# EAGLE schematic pmod_debug (EAGLE 6.4.4)
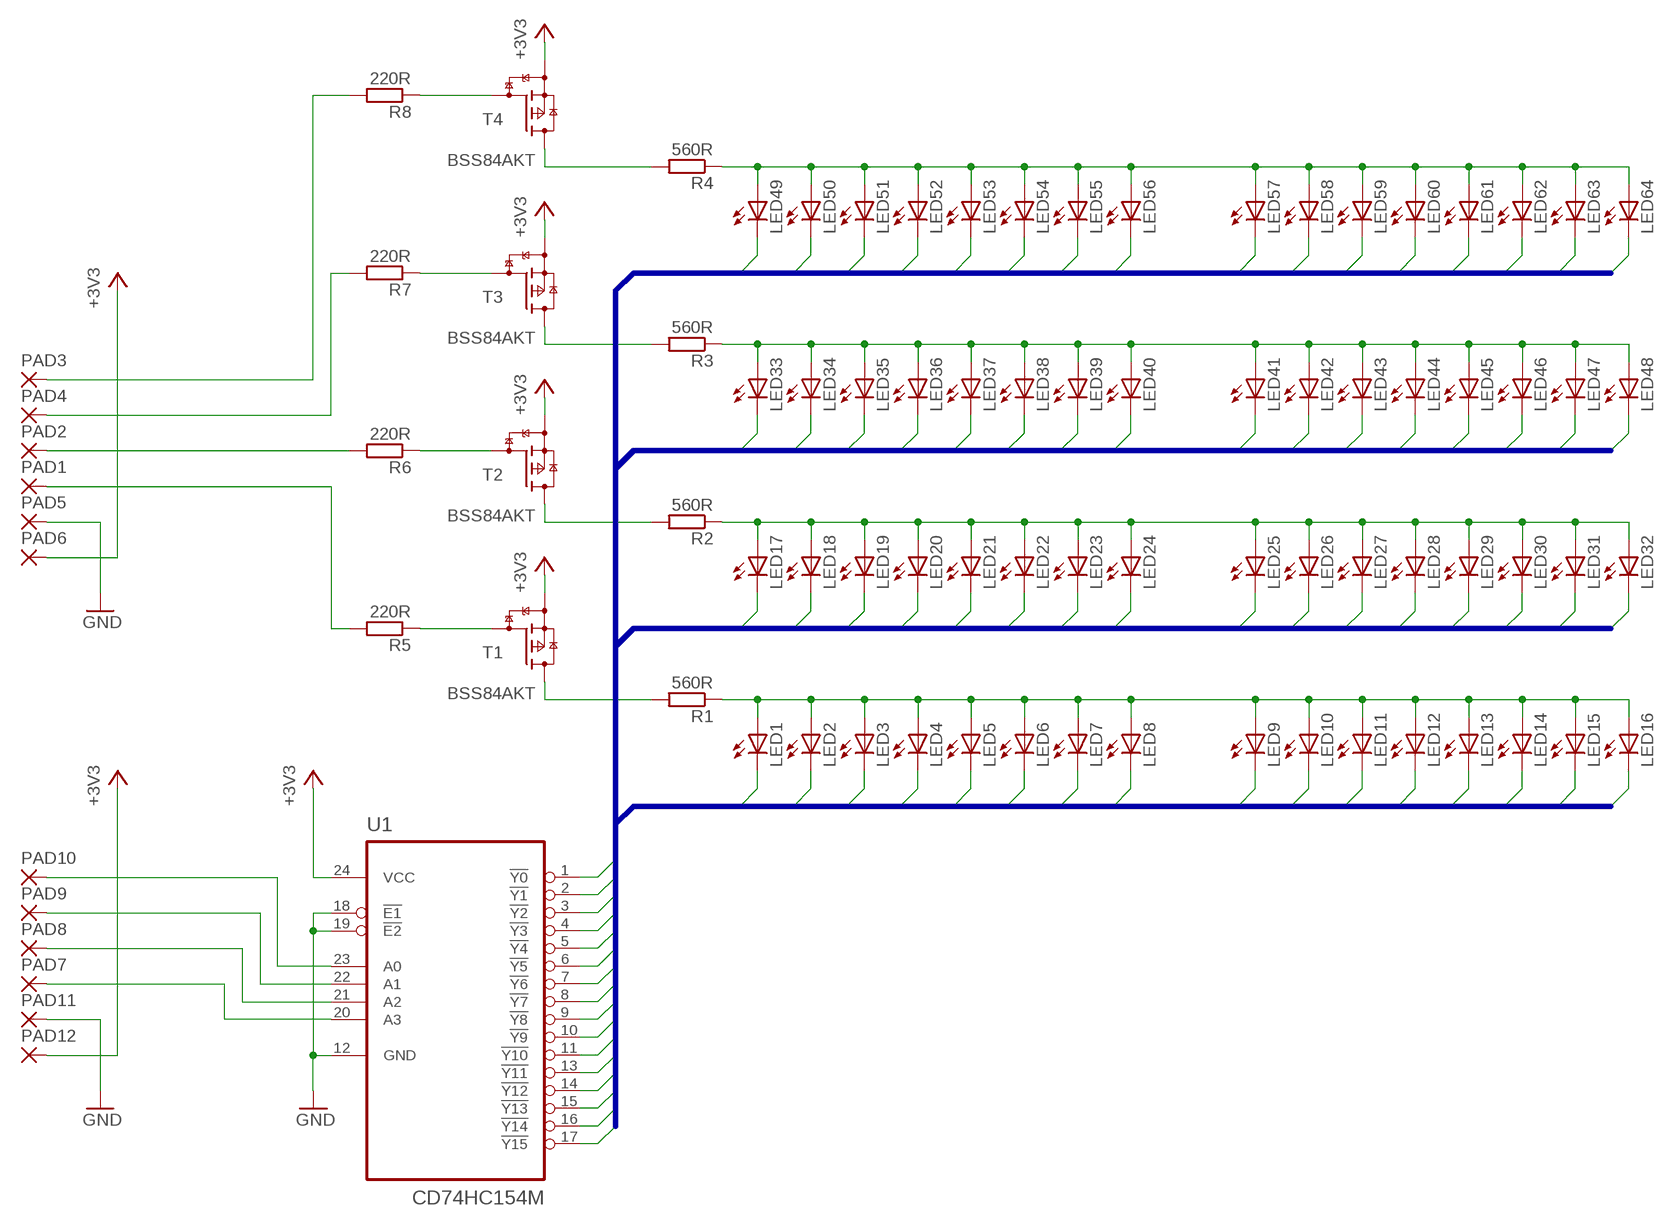
[diagram p0: schematic, sheet 1]

## Parts
LED1  LEDCHIP-LED0603  [CHIP-LED0603]
LED2  LEDCHIP-LED0603  [CHIP-LED0603]
LED3  LEDCHIP-LED0603  [CHIP-LED0603]
LED4  LEDCHIP-LED0603  [CHIP-LED0603]
LED5  LEDCHIP-LED0603  [CHIP-LED0603]
LED6  LEDCHIP-LED0603  [CHIP-LED0603]
LED7  LEDCHIP-LED0603  [CHIP-LED0603]
LED8  LEDCHIP-LED0603  [CHIP-LED0603]
LED9  LEDCHIP-LED0603  [CHIP-LED0603]
LED10  LEDCHIP-LED0603  [CHIP-LED0603]
LED11  LEDCHIP-LED0603  [CHIP-LED0603]
LED12  LEDCHIP-LED0603  [CHIP-LED0603]
LED13  LEDCHIP-LED0603  [CHIP-LED0603]
LED14  LEDCHIP-LED0603  [CHIP-LED0603]
LED15  LEDCHIP-LED0603  [CHIP-LED0603]
LED16  LEDCHIP-LED0603  [CHIP-LED0603]
LED17  LEDCHIP-LED0603  [CHIP-LED0603]
LED18  LEDCHIP-LED0603  [CHIP-LED0603]
LED19  LEDCHIP-LED0603  [CHIP-LED0603]
LED20  LEDCHIP-LED0603  [CHIP-LED0603]
LED21  LEDCHIP-LED0603  [CHIP-LED0603]
LED22  LEDCHIP-LED0603  [CHIP-LED0603]
LED23  LEDCHIP-LED0603  [CHIP-LED0603]
LED24  LEDCHIP-LED0603  [CHIP-LED0603]
LED25  LEDCHIP-LED0603  [CHIP-LED0603]
LED26  LEDCHIP-LED0603  [CHIP-LED0603]
LED27  LEDCHIP-LED0603  [CHIP-LED0603]
LED28  LEDCHIP-LED0603  [CHIP-LED0603]
LED29  LEDCHIP-LED0603  [CHIP-LED0603]
LED30  LEDCHIP-LED0603  [CHIP-LED0603]
LED31  LEDCHIP-LED0603  [CHIP-LED0603]
LED32  LEDCHIP-LED0603  [CHIP-LED0603]
LED33  LEDCHIP-LED0603  [CHIP-LED0603]
LED34  LEDCHIP-LED0603  [CHIP-LED0603]
LED35  LEDCHIP-LED0603  [CHIP-LED0603]
LED36  LEDCHIP-LED0603  [CHIP-LED0603]
LED37  LEDCHIP-LED0603  [CHIP-LED0603]
LED38  LEDCHIP-LED0603  [CHIP-LED0603]
LED39  LEDCHIP-LED0603  [CHIP-LED0603]
LED40  LEDCHIP-LED0603  [CHIP-LED0603]
LED41  LEDCHIP-LED0603  [CHIP-LED0603]
LED42  LEDCHIP-LED0603  [CHIP-LED0603]
LED43  LEDCHIP-LED0603  [CHIP-LED0603]
LED44  LEDCHIP-LED0603  [CHIP-LED0603]
LED45  LEDCHIP-LED0603  [CHIP-LED0603]
LED46  LEDCHIP-LED0603  [CHIP-LED0603]
LED47  LEDCHIP-LED0603  [CHIP-LED0603]
LED48  LEDCHIP-LED0603  [CHIP-LED0603]
LED49  LEDCHIP-LED0603  [CHIP-LED0603]
LED50  LEDCHIP-LED0603  [CHIP-LED0603]
LED51  LEDCHIP-LED0603  [CHIP-LED0603]
LED52  LEDCHIP-LED0603  [CHIP-LED0603]
LED53  LEDCHIP-LED0603  [CHIP-LED0603]
LED54  LEDCHIP-LED0603  [CHIP-LED0603]
LED55  LEDCHIP-LED0603  [CHIP-LED0603]
LED56  LEDCHIP-LED0603  [CHIP-LED0603]
LED57  LEDCHIP-LED0603  [CHIP-LED0603]
LED58  LEDCHIP-LED0603  [CHIP-LED0603]
LED59  LEDCHIP-LED0603  [CHIP-LED0603]
LED60  LEDCHIP-LED0603  [CHIP-LED0603]
LED61  LEDCHIP-LED0603  [CHIP-LED0603]
LED62  LEDCHIP-LED0603  [CHIP-LED0603]
LED63  LEDCHIP-LED0603  [CHIP-LED0603]
LED64  LEDCHIP-LED0603  [CHIP-LED0603]
PAD1  SMD2HR  [SMD1.27-3.175HR]
PAD2  SMD2HR  [SMD1.27-3.175HR]
PAD3  SMD2HR  [SMD1.27-3.175HR]
PAD4  SMD2HR  [SMD1.27-3.175HR]
PAD5  SMD2HR  [SMD1.27-3.175HR]
PAD6  SMD2HR  [SMD1.27-3.175HR]
PAD7  SMD2HR  [SMD1.27-3.175HR]
PAD8  SMD2HR  [SMD1.27-3.175HR]
PAD9  SMD2HR  [SMD1.27-3.175HR]
PAD10  SMD2HR  [SMD1.27-3.175HR]
PAD11  SMD2HR  [SMD1.27-3.175HR]
PAD12  SMD2HR  [SMD1.27-3.175HR]
R1  560R  R-EU_R0402  [R0402]
R2  560R  R-EU_R0402  [R0402]
R3  560R  R-EU_R0402  [R0402]
R4  560R  R-EU_R0402  [R0402]
R5  220R  R-EU_R0402  [R0402]
R6  220R  R-EU_R0402  [R0402]
R7  220R  R-EU_R0402  [R0402]
R8  220R  R-EU_R0402  [R0402]
T1  BSS84AKT  [SOT416]
T2  BSS84AKT  [SOT416]
T3  BSS84AKT  [SOT416]
T4  BSS84AKT  [SOT416]
U1  CD74HC154M  [SOIC127P1030X265-24N]

## Nets
+3V3: PAD6.1(P) PAD12.1(P) T1.2(S) T2.2(S) T3.2(S) T4.2(S) U1.24(VCC)
C0: LED1.C LED17.C LED33.C LED49.C U1.1(!Y0)
C1: LED2.C LED18.C LED34.C LED50.C U1.2(!Y1)
C2: LED3.C LED19.C LED35.C LED51.C U1.3(!Y2)
C3: LED4.C LED20.C LED36.C LED52.C U1.4(!Y3)
C4: LED5.C LED21.C LED37.C LED53.C U1.5(!Y4)
C5: LED6.C LED22.C LED38.C LED54.C U1.6(!Y5)
C6: LED7.C LED23.C LED39.C LED55.C U1.7(!Y6)
C7: LED8.C LED24.C LED40.C LED56.C U1.8(!Y7)
C8: LED9.C LED25.C LED41.C LED57.C U1.9(!Y8)
C9: LED10.C LED26.C LED42.C LED58.C U1.10(!Y9)
C10: LED11.C LED27.C LED43.C LED59.C U1.11(!Y10)
C11: LED12.C LED28.C LED44.C LED60.C U1.13(!Y11)
C12: LED13.C LED29.C LED45.C LED61.C U1.14(!Y12)
C13: LED14.C LED30.C LED46.C LED62.C U1.15(!Y13)
C14: LED15.C LED31.C LED47.C LED63.C U1.16(!Y14)
C15: LED16.C LED32.C LED48.C LED64.C U1.17(!Y15)
GND: PAD5.1(P) PAD11.1(P) U1.12(GND) U1.18(!E1) U1.19(!E2)
N$1: LED1.A LED2.A LED3.A LED4.A LED5.A LED6.A LED7.A LED8.A LED9.A LED10.A LED11.A LED12.A LED13.A LED14.A LED15.A LED16.A R1.1
N$2: LED17.A LED18.A LED19.A LED20.A LED21.A LED22.A LED23.A LED24.A LED25.A LED26.A LED27.A LED28.A LED29.A LED30.A LED31.A LED32.A R2.1
N$3: LED33.A LED34.A LED35.A LED36.A LED37.A LED38.A LED39.A LED40.A LED41.A LED42.A LED43.A LED44.A LED45.A LED46.A LED47.A LED48.A R3.1
N$4: LED49.A LED50.A LED51.A LED52.A LED53.A LED54.A LED55.A LED56.A LED57.A LED58.A LED59.A LED60.A LED61.A LED62.A LED63.A LED64.A R4.1
N$5: R4.2 T4.3(D)
N$6: R3.2 T3.3(D)
N$7: R1.2 T1.3(D)
N$8: R2.2 T2.3(D)
N$9: R8.1 T4.1(G)
N$10: R7.1 T3.1(G)
N$11: R5.1 T1.1(G)
N$12: R6.1 T2.1(G)
N$13: PAD10.1(P) U1.23(A0)
N$14: PAD9.1(P) U1.22(A1)
N$15: PAD8.1(P) U1.21(A2)
N$16: PAD7.1(P) U1.20(A3)
N$17: PAD1.1(P) R5.2
N$18: PAD2.1(P) R6.2
N$19: PAD3.1(P) R8.2
N$20: PAD4.1(P) R7.2

## Buses
C[0..15]

## Library data of the parts
LED1-LED64 = led:LED: LED OSRAM: - CHIPLED LG R971, LG N971, LY N971, LG Q971, LY Q971, LO R971, LY R971 LH N974, LH R974 LS Q976, LO Q976, LY Q976 LO Q996 - Hyper CHIPLED LW Q18S LB Q993, LB Q99A, LB R99A - SideLED LS A670, LO A670, LY A670, LG A670, LP A670 LB A673, LV A673, LT A673, LW A673 LH A674 LY A675 LS A676, LA A676, LO A676, LY A676, LW A676 LS A679, LY A679, LG A679 - Hyper Micro SIDELED® LS Y876, LA Y876, LO Y876, LY Y876 LT Y87S - SmartLED LW L88C, LW L88S LB L89C, LB L89S, LG L890 LS L89K, LO L89K, LY L89K LS L896, LA L896, LO L896, LY L896 - TOPLED LS T670, LO T670, LY T670, LG T670, LP T670 LSG T670, LSP T670, LSY T670, LOP T670, LYG T670 LG T671, LOG T671, LSG T671 LB T673, LV T673, LT T673, LW T673 LH T674 LS T676, LA T676, LO T676, LY T676, LB T676, LH T676, LSB T676, LW T676 LB T67C, LV T67C, LT T67C, LS T67K, LO T67K, LY T67K, LW E67C LS E67B, LA E67B, LO E67B, LY E67B, LB E67C, LV E67C, LT E67C LW T67C LS T679, LY T679, LG T679 LS T770, LO T770, LY T770, LG T770, LP T770 LB T773, LV T773, LT T773, LW T773 LH T774 LS E675, LA E675, LY E675, LS T675 LS T776, LA T776, LO T776, LY T776, LB T776 LHGB T686 LT T68C, LB T68C - Hyper Mini TOPLED® LB M676 - Mini TOPLED Santana® LG M470 LS M47K, LO M47K, LY M47K Source: http://www.osram.convergy.de LUXEON: - LUMILED® LXK2-PW12-R00, LXK2-PW12-S00, LXK2-PW14-U00, LXK2-PW14-V00 LXK2-PM12-R00, LXK2-PM12-S00, LXK2-PM14-U00 LXK2-PE12-Q00, LXK2-PE12-R00, LXK2-PE12-S00, LXK2-PE14-T00, LXK2-PE14-U00 LXK2-PB12-K00, LXK2-PB12-L00, LXK2-PB12-M00, LXK2-PB14-N00, LXK2-PB14-P00, LXK2-PB14-Q00 LXK2-PR12-L00, LXK2-PR12-M00, LXK2-PR14-Q00, LXK2-PR14-R00 LXK2-PD12-Q00, LXK2-PD12-R00, LXK2-PD12-S00 LXK2-PH12-R00, LXK2-PH12-S00 LXK2-PL12-P00, LXK2-PL12-Q00, LXK2-PL12-R00 Source: www.luxeon.com KINGBRIGHT: KA-3528ASYC Source: www.kingbright.com
PAD1-PAD12 = wirepad:SMD2: SMD PAD
R1-R8 = rcl:R-EU_: RESISTOR, European symbol
T1-T4 = nxp_60:BSS84A: 50 V, 150 mA P-channel Trench MOSFET P-channel enhancement mode Field-Effect Transistor (FET) in a small Surface-Mounted Device (SMD) plastic package using Trench MOSFET technology. AAL Eindhoven MK
U1 = 74hc154:CD74HC154M: High-Speed CMOS Logic 4- to 16-Line Decoder/Demultiplexer; MPN: CD74HC154M; OC_FARNELL: 1640550; OC_NEWARK: 66F5185; PACKAGE: SOIC-24; SUPPLIER: Texas Instruments